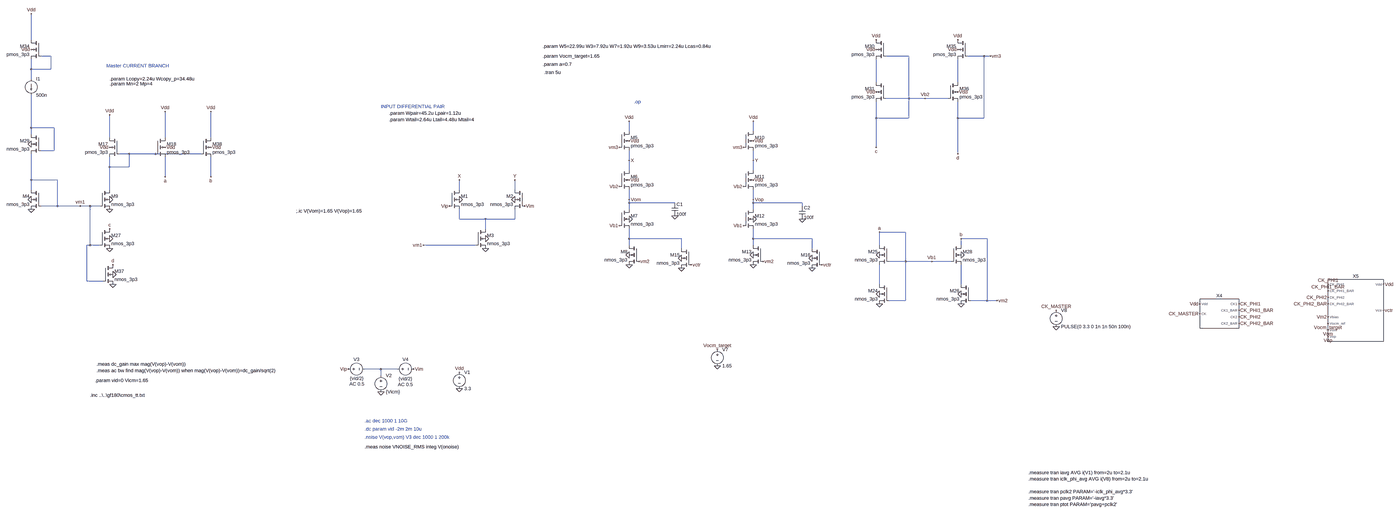
[diagram p0: schematic ota_v2.asc, whole sheet]
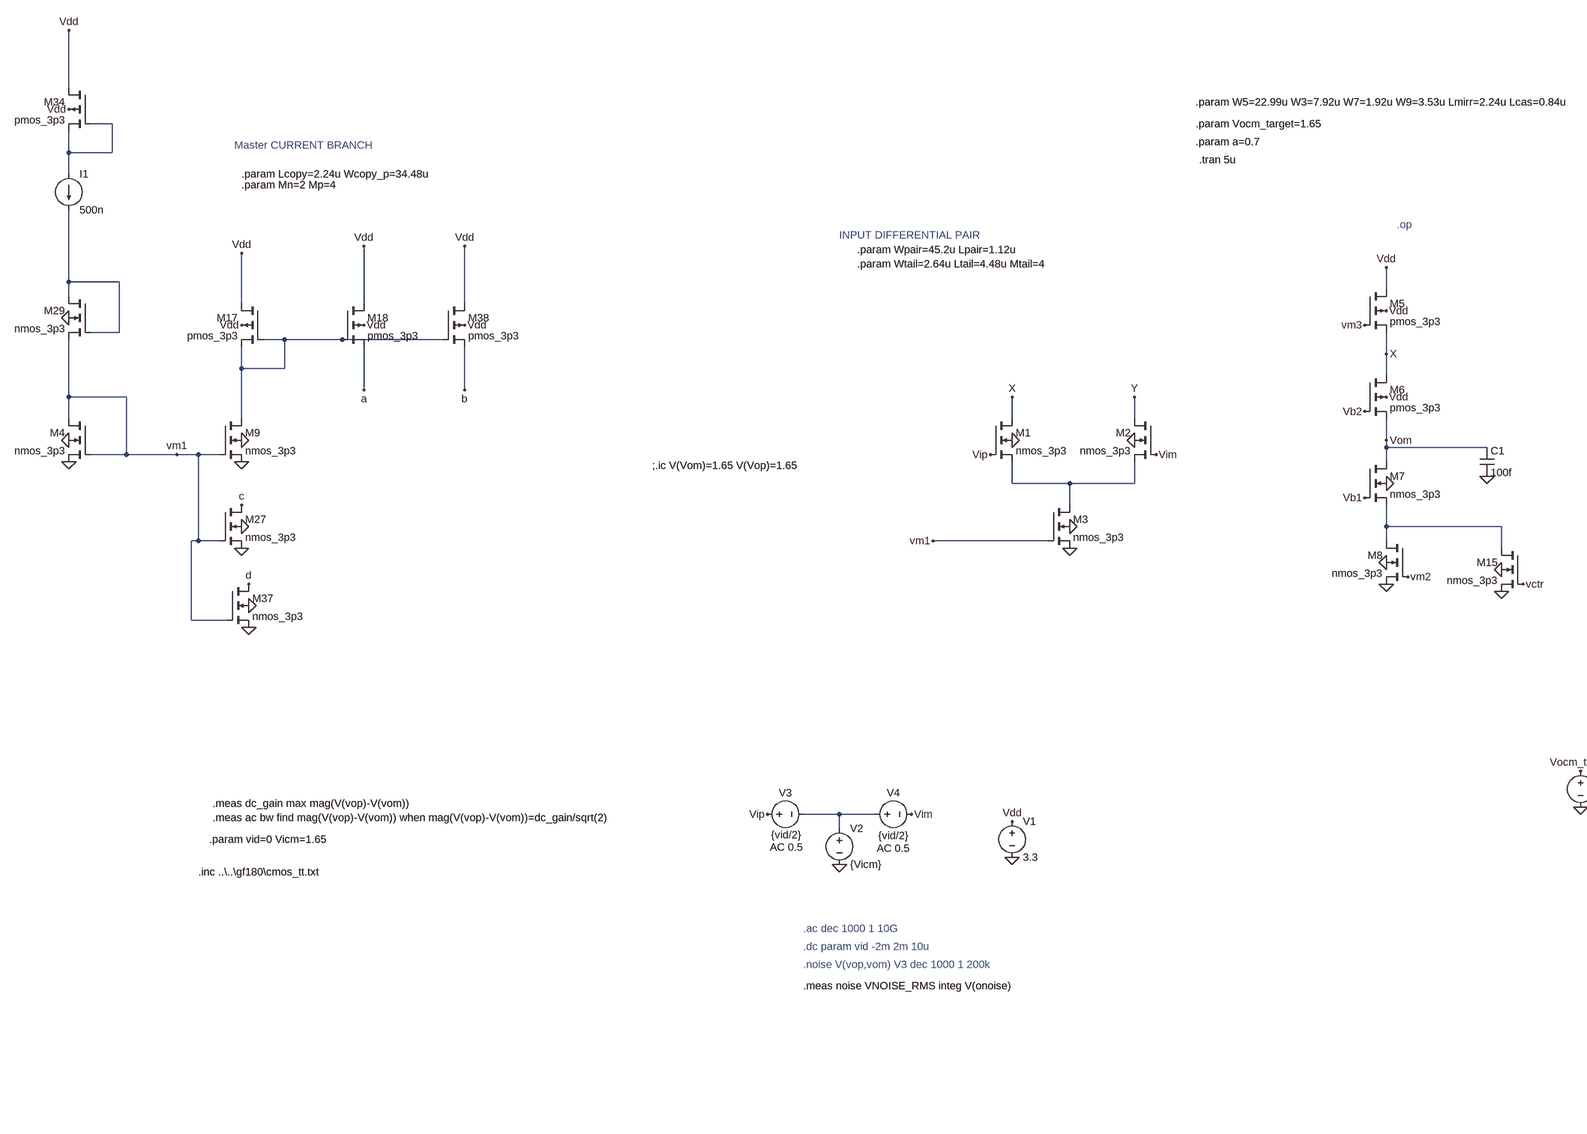
[diagram p1: schematic ota_v2.asc, part, row 1 of 1, column 1 of 2]
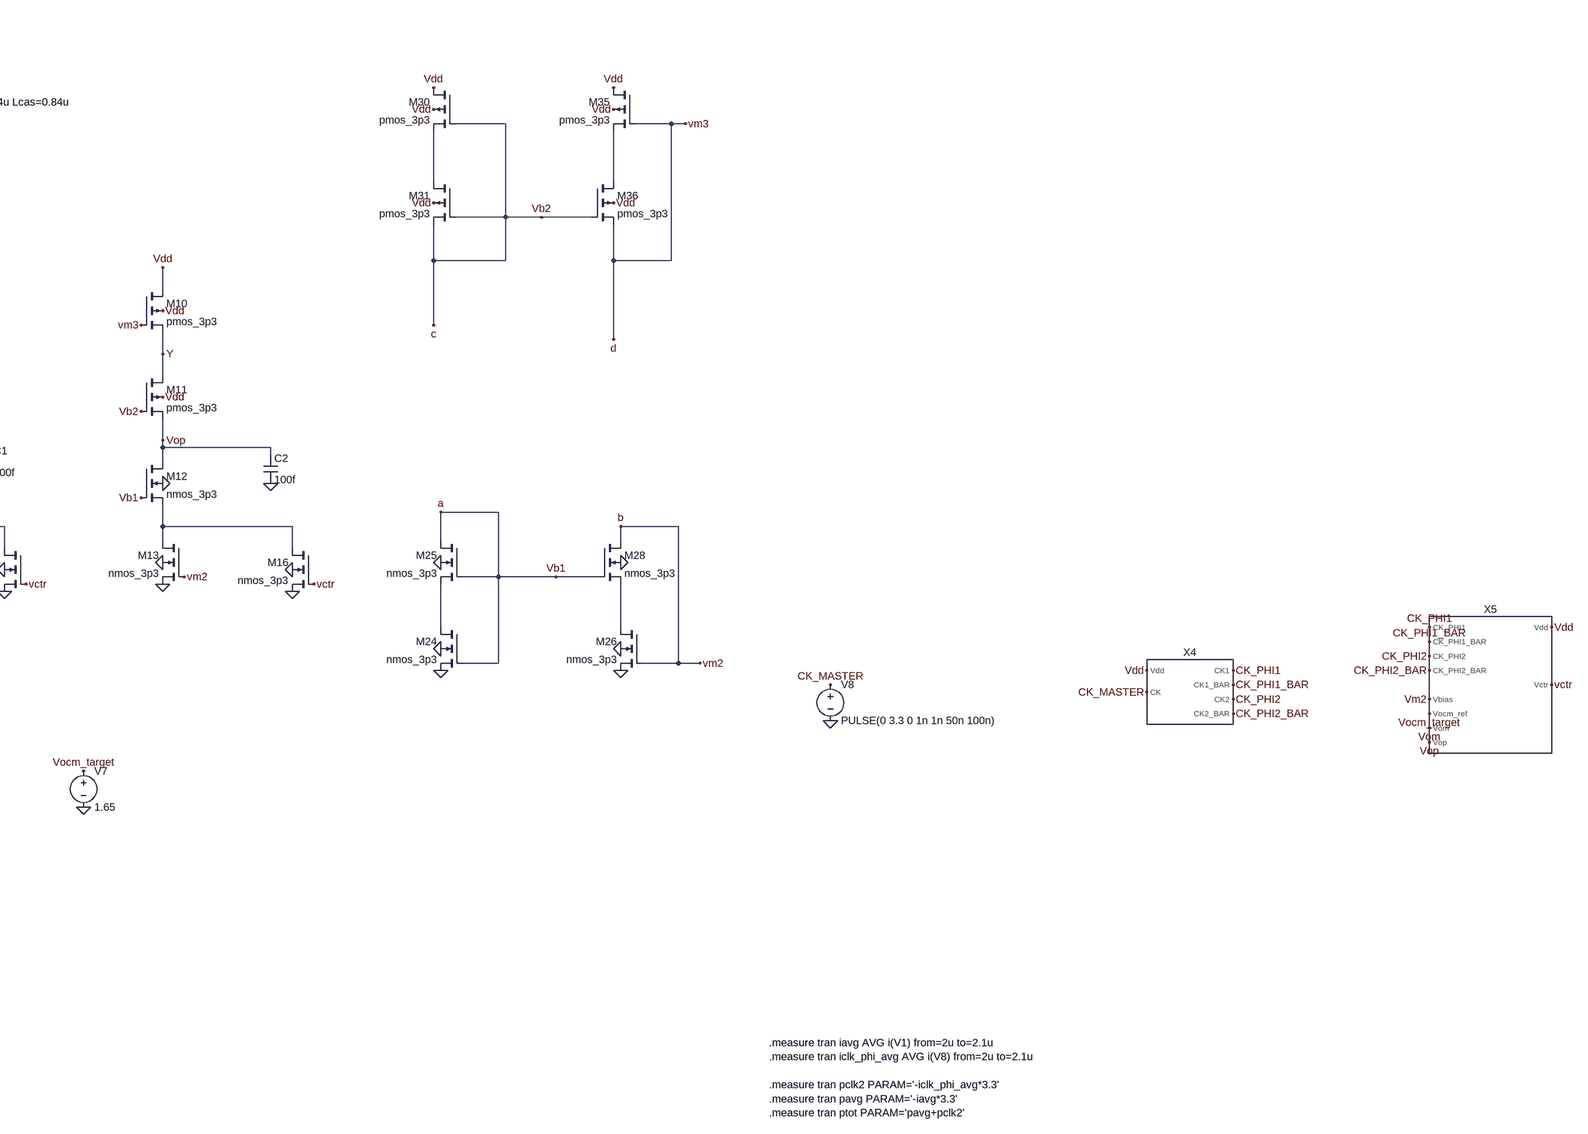
[diagram p2: schematic ota_v2.asc, part, row 1 of 1, column 2 of 2]
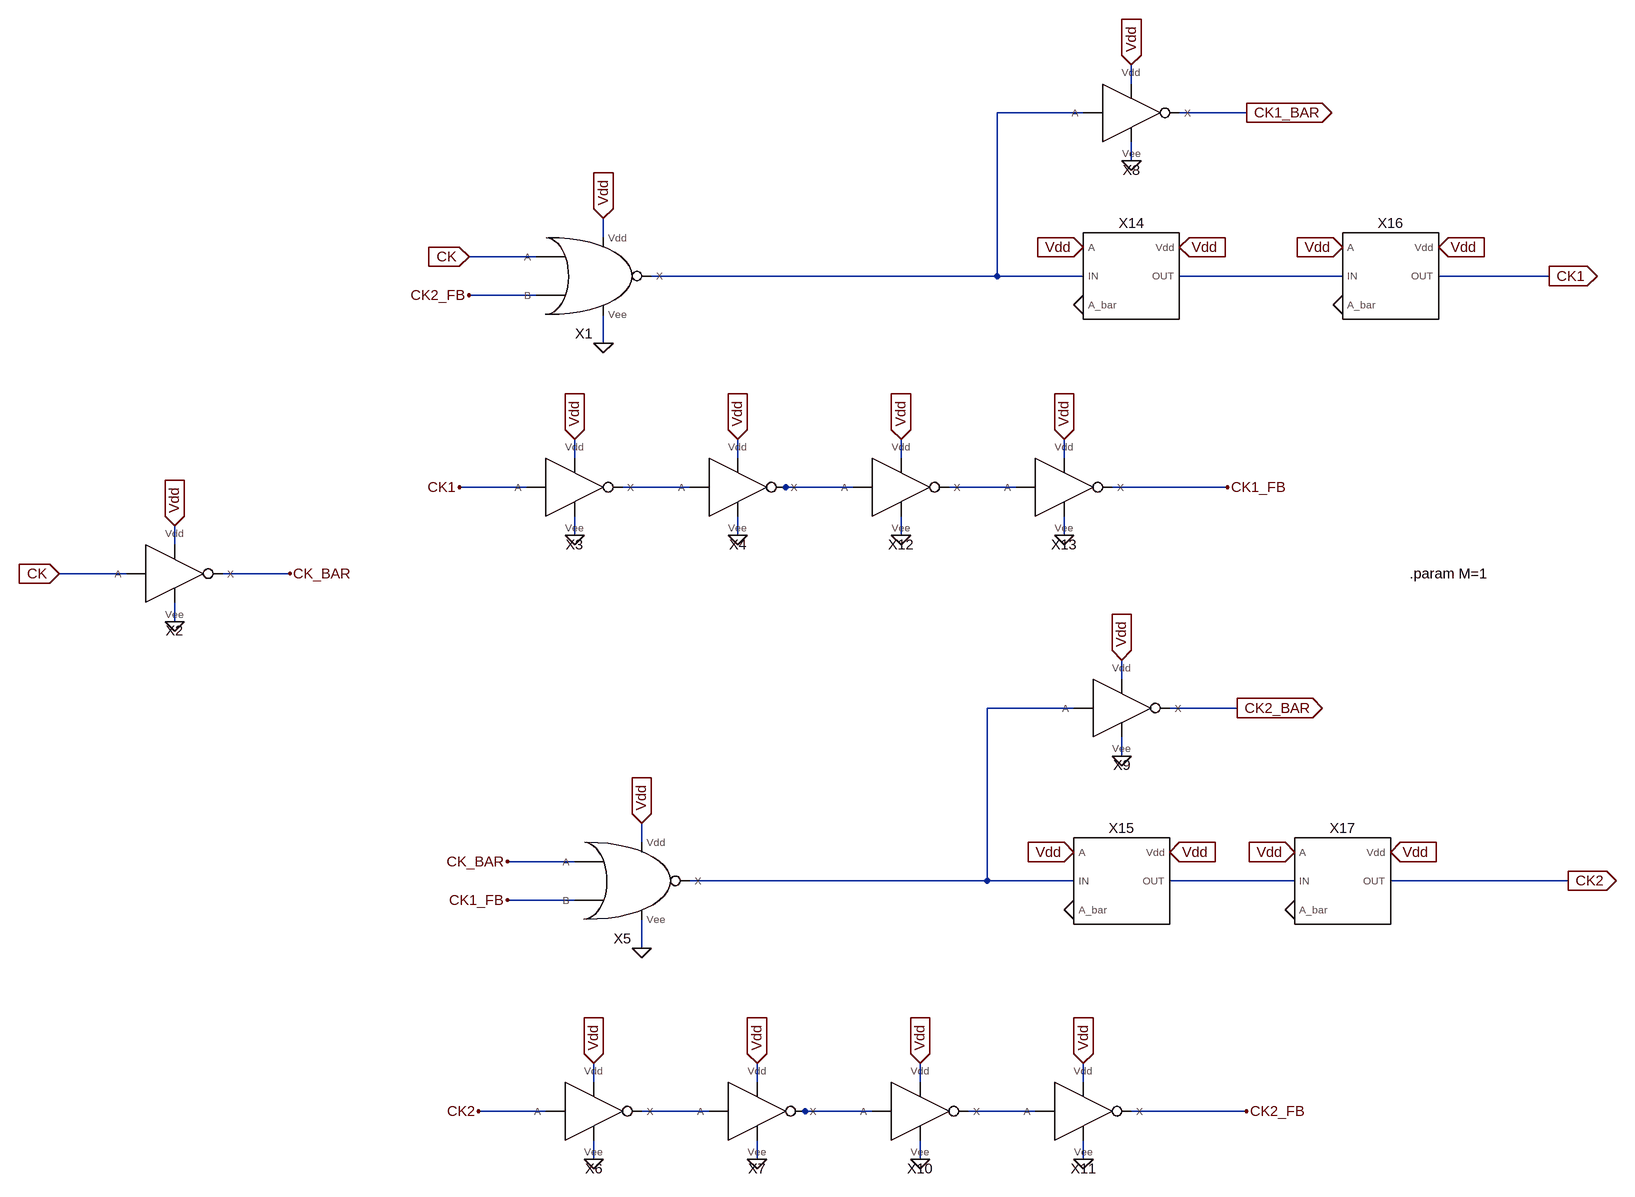
[diagram p3: sub-circuit phase_gen.asc]
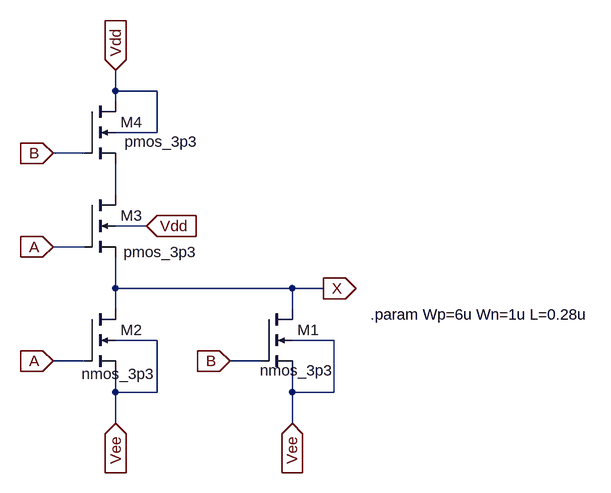
[diagram p4: sub-circuit nor2x1.asc]
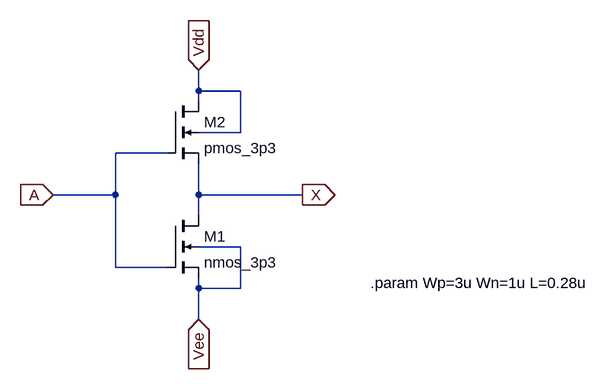
[diagram p5: sub-circuit invx1.asc]
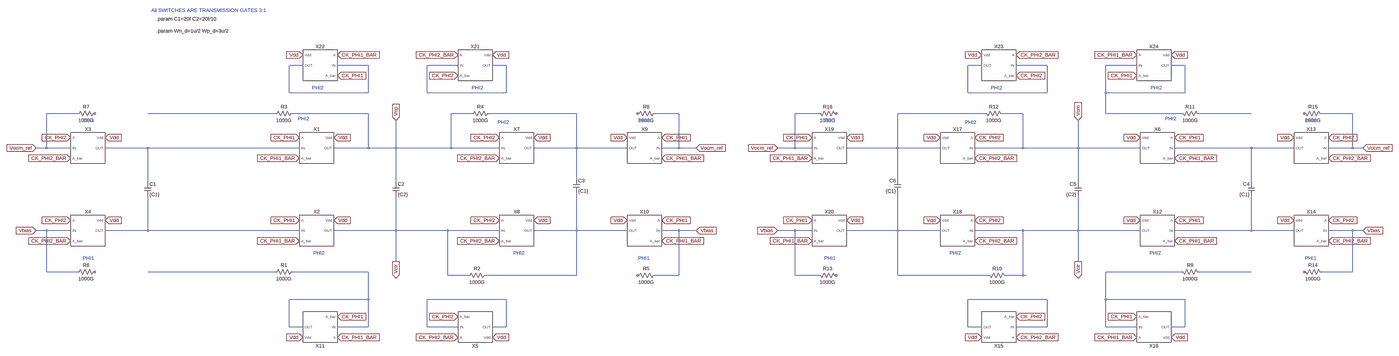
[diagram p6: sub-circuit cs_cmfb_v2.asc, whole sheet]
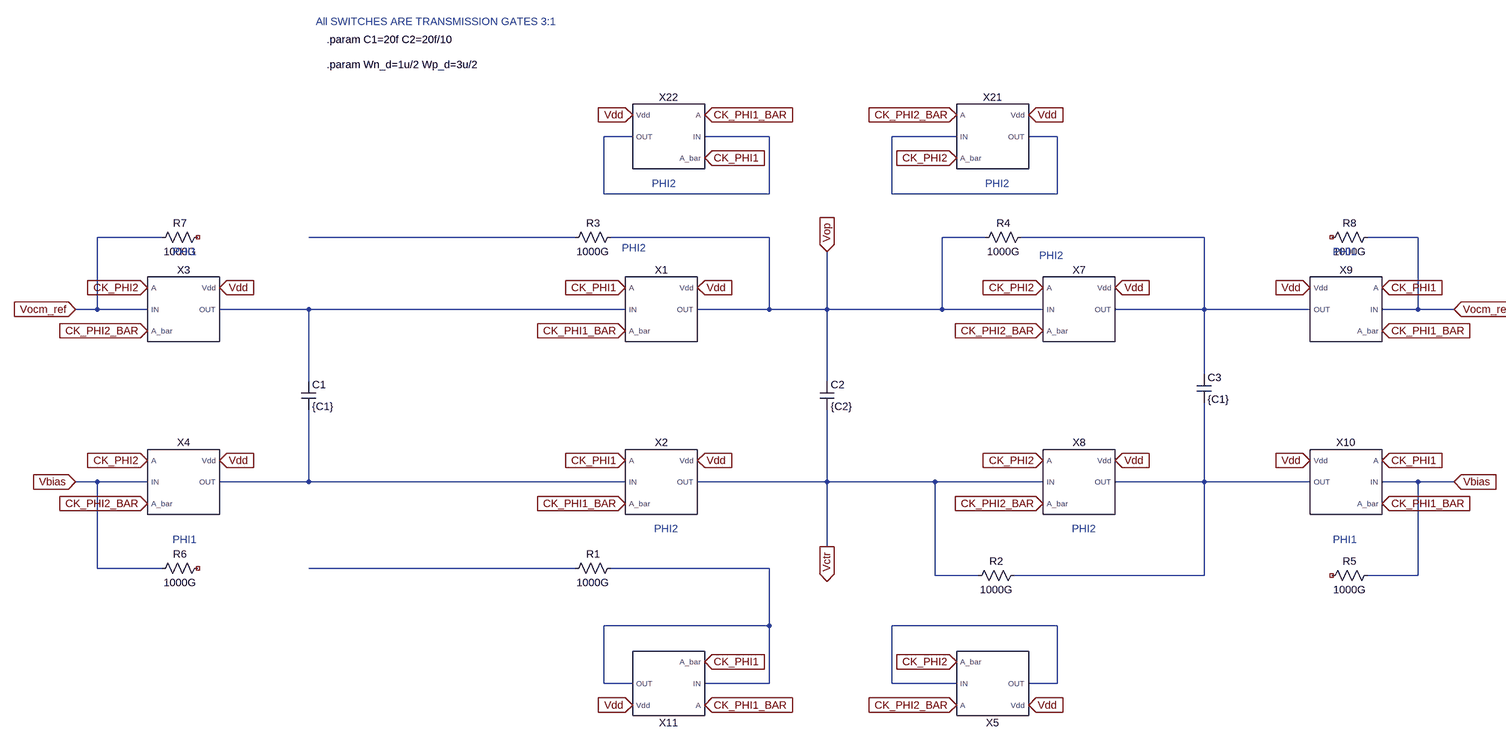
[diagram p7: sub-circuit cs_cmfb_v2.asc, part, row 1 of 1, column 1 of 2]
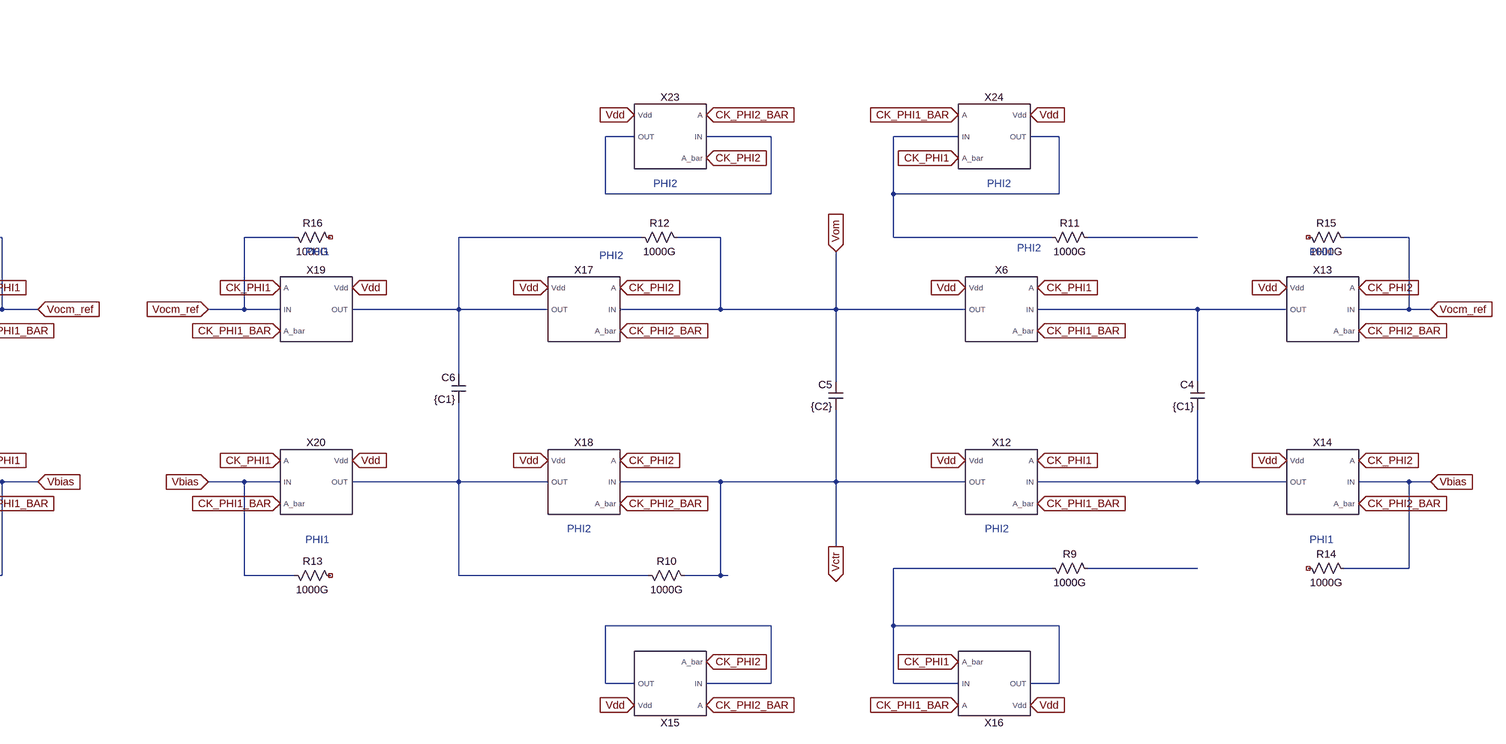
[diagram p8: sub-circuit cs_cmfb_v2.asc, part, row 1 of 1, column 2 of 2]
ota_v2.asc, the LTspice schematic file:
Version 4
SHEET 1 6080 1908
WIRE -1936 -560 -1936 -688
WIRE -1840 -480 -1888 -480
WIRE 3312 -480 3200 -480
WIRE 3680 -480 3600 -480
WIRE 3712 -480 3680 -480
WIRE -1936 -416 -1936 -464
WIRE -1840 -416 -1840 -480
WIRE -1840 -416 -1936 -416
WIRE -1936 -368 -1936 -416
WIRE 3152 -352 3152 -464
WIRE 3552 -352 3552 -464
WIRE 3312 -272 3312 -480
WIRE 3312 -272 3200 -272
WIRE 3392 -272 3312 -272
WIRE 3504 -272 3392 -272
WIRE 3152 -176 3152 -256
WIRE 3312 -176 3312 -272
WIRE 3312 -176 3152 -176
WIRE 3552 -176 3552 -256
WIRE 3680 -176 3680 -480
WIRE 3680 -176 3552 -176
WIRE -1936 -128 -1936 -288
WIRE -1824 -128 -1936 -128
WIRE 1040 -112 1040 -160
WIRE 1648 -112 1648 -160
WIRE -1936 -96 -1936 -128
WIRE -1552 -80 -1552 -192
WIRE -1280 -80 -1280 -208
WIRE -1056 -80 -1056 -208
WIRE 3152 -32 3152 -176
WIRE -1824 -16 -1824 -128
WIRE -1824 -16 -1888 -16
WIRE -1456 0 -1504 0
WIRE -1328 0 -1456 0
WIRE -1104 0 -1328 0
WIRE 3552 0 3552 -176
WIRE 1040 32 1040 -16
WIRE 1648 32 1648 -16
WIRE -1552 64 -1552 16
WIRE -1456 64 -1456 0
WIRE -1456 64 -1552 64
WIRE 1040 80 1040 32
WIRE 1648 80 1648 32
WIRE -1280 112 -1280 16
WIRE -1056 112 -1056 16
WIRE -1936 128 -1936 0
WIRE -1808 128 -1936 128
WIRE -1936 176 -1936 128
WIRE -1552 176 -1552 64
WIRE 208 176 208 128
WIRE 480 176 480 128
WIRE 1040 224 1040 176
WIRE 1648 224 1648 176
WIRE 1040 240 1040 224
WIRE 1264 240 1040 240
WIRE 1648 240 1648 224
WIRE 1888 240 1648 240
WIRE -1808 256 -1808 128
WIRE -1808 256 -1888 256
WIRE -1696 256 -1808 256
WIRE -1648 256 -1696 256
WIRE -1600 256 -1648 256
WIRE 1888 256 1888 240
WIRE 1040 272 1040 240
WIRE 1648 272 1648 240
WIRE 208 320 208 272
WIRE 336 320 208 320
WIRE 480 320 480 272
WIRE 480 320 336 320
WIRE 336 368 336 320
WIRE 3296 384 3168 384
WIRE 1040 416 1040 368
WIRE 1296 416 1040 416
WIRE 1648 416 1648 368
WIRE 1936 416 1648 416
WIRE 3696 416 3568 416
WIRE -1648 448 -1648 256
WIRE -1648 448 -1664 448
WIRE -1600 448 -1648 448
WIRE 288 448 32 448
WIRE 1040 448 1040 416
WIRE 1648 448 1648 416
WIRE 3168 448 3168 384
WIRE 3568 448 3568 416
WIRE 1296 464 1296 416
WIRE 1936 464 1936 416
WIRE 3296 528 3296 384
WIRE 3296 528 3216 528
WIRE 3424 528 3296 528
WIRE 3520 528 3424 528
WIRE -1664 624 -1664 448
WIRE -1584 624 -1664 624
WIRE 3168 640 3168 544
WIRE 3568 640 3568 544
WIRE 3296 720 3296 528
WIRE 3296 720 3216 720
WIRE 3696 720 3696 416
WIRE 3696 720 3616 720
WIRE 3744 720 3696 720
WIRE -176 1056 -256 1056
WIRE -96 1056 -176 1056
WIRE -176 1088 -176 1056
FLAG 336 464 0
FLAG 208 224 0
FLAG 480 224 0
FLAG 336 416 0
FLAG -1936 272 0
FLAG -1936 224 0
FLAG 208 1152 0
FLAG 208 1072 Vdd
FLAG -176 1168 0
FLAG -336 1056 Vip
FLAG -16 1056 Vim
FLAG 160 256 Vip
FLAG 528 256 Vim
FLAG 1040 -160 Vdd
FLAG 1040 544 0
FLAG 1040 496 0
FLAG 1040 320 0
FLAG 1040 32 X
FLAG 1040 128 Vdd
FLAG 992 352 Vb1
FLAG 992 160 Vb2
FLAG 1040 -64 Vdd
FLAG 1648 -160 Vdd
FLAG 1648 544 0
FLAG 1648 496 0
FLAG 1648 320 0
FLAG 1648 32 Y
FLAG 1648 128 Vdd
FLAG 1600 352 Vb1
FLAG 1600 160 Vb2
FLAG 1648 -64 Vdd
FLAG 1696 528 vm2
FLAG 1088 528 vm2
FLAG 1600 -32 vm3
FLAG 992 -32 vm3
FLAG 1648 224 Vop
FLAG 1040 224 Vom
FLAG 208 128 X
FLAG 480 128 Y
FLAG 1472 1040 0
FLAG 1472 960 Vocm_target
FLAG -1696 256 vm1
FLAG 1296 560 0
FLAG 1296 512 0
FLAG 1344 544 vctr
FLAG 1936 560 0
FLAG 1936 512 0
FLAG 1984 544 vctr
FLAG 1264 304 0
FLAG 1888 320 0
FLAG 32 448 vm1
FLAG -1552 272 0
FLAG -1552 224 0
FLAG -1552 -32 Vdd
FLAG -1552 -192 Vdd
FLAG -1280 -32 Vdd
FLAG -1280 -208 Vdd
FLAG -1280 112 a
FLAG -1552 464 0
FLAG -1552 416 0
FLAG -1552 368 c
FLAG -1936 -688 Vdd
FLAG -1936 -48 0
FLAG -1936 -512 Vdd
FLAG 3168 736 0
FLAG 3168 688 0
FLAG 3168 496 0
FLAG 3568 736 0
FLAG 3568 688 0
FLAG 3744 720 vm2
FLAG 3568 496 0
FLAG 3424 528 Vb1
FLAG 3152 -512 Vdd
FLAG 3152 -560 Vdd
FLAG 3152 -304 Vdd
FLAG 3552 -512 Vdd
FLAG 3552 -560 Vdd
FLAG 3552 -304 Vdd
FLAG 3712 -480 vm3
FLAG 3392 -272 Vb2
FLAG 3168 384 a
FLAG 3568 416 b
FLAG 3152 -32 c
FLAG 3552 0 d
FLAG -1536 640 0
FLAG -1536 592 0
FLAG -1536 544 d
FLAG -1056 -32 Vdd
FLAG -1056 -208 Vdd
FLAG -1056 112 b
FLAG 5744 704 CK_PHI2
FLAG 5744 640 CK_PHI1
FLAG 5744 736 CK_PHI2_BAR
FLAG 5744 672 CK_PHI1_BAR
FLAG 6016 640 Vdd
FLAG 5744 800 Vm2
FLAG 6016 768 vctr
FLAG 5744 832 Vocm_target
FLAG 5744 864 Vom
FLAG 5744 896 Vop
FLAG 4224 848 0
FLAG 4224 768 CK_MASTER
FLAG 4976 736 Vdd
FLAG 4976 784 CK_MASTER
FLAG 5168 736 CK_PHI1
FLAG 5168 768 CK_PHI1_BAR
FLAG 5168 800 CK_PHI2
FLAG 5168 832 CK_PHI2_BAR
SYMBOL nmos4 160 176 R0
SYMATTR InstName M1
SYMATTR Value nmos_3p3
SYMATTR Value2 l='Lpair' w='Wpair' m=1
SYMBOL nmos4 528 176 M0
SYMATTR InstName M2
SYMATTR Value nmos_3p3
SYMATTR Value2 l='Lpair' w='Wpair' m=1
SYMBOL nmos4 288 368 R0
SYMATTR InstName M3
SYMATTR Value nmos_3p3
SYMATTR Value2 l='Ltail' w='Wtail/Mtail' m=Mtail
SYMBOL nmos4 -1888 176 M0
SYMATTR InstName M4
SYMATTR Value nmos_3p3
SYMATTR Value2 l='Ltail' w='Wtail/Mtail' m=1
SYMBOL voltage 208 1056 R0
WINDOW 123 24 124 Left 2
WINDOW 39 0 0 Left 0
SYMATTR InstName V1
SYMATTR Value 3.3
SYMBOL voltage -176 1072 R0
WINDOW 123 24 124 Left 2
WINDOW 39 0 0 Left 0
SYMATTR InstName V2
SYMATTR Value {Vicm}
SYMBOL voltage -352 1056 R270
WINDOW 0 32 56 VTop 2
WINDOW 3 -30 58 VBottom 2
WINDOW 123 -58 58 VBottom 2
WINDOW 39 0 0 Left 0
SYMATTR InstName V3
SYMATTR Value {vid/2}
SYMATTR Value2 AC 0.5
SYMBOL voltage -112 1056 R270
WINDOW 0 32 56 VTop 2
WINDOW 3 -32 56 VBottom 2
WINDOW 123 -60 56 VBottom 2
WINDOW 39 0 0 Left 0
SYMATTR InstName V4
SYMATTR Value {vid/2}
SYMATTR Value2 AC 0.5
SYMBOL pmos4 992 -112 R0
SYMATTR InstName M5
SYMATTR Value pmos_3p3
SYMATTR Value2 l='Lmirr' w='W5/3' m=3
SYMBOL pmos4 992 80 R0
SYMATTR InstName M6
SYMATTR Value pmos_3p3
SYMATTR Value2 l='Lcas' w='W3/2' m=2
SYMBOL nmos4 992 272 R0
SYMATTR InstName M7
SYMATTR Value nmos_3p3
SYMATTR Value2 l='Lcas' w='W7'
SYMBOL nmos4 1088 448 M0
SYMATTR InstName M8
SYMATTR Value nmos_3p3
SYMATTR Value2 l='Lmirr' w='a*W9'
SYMBOL pmos4 1600 -112 R0
SYMATTR InstName M10
SYMATTR Value pmos_3p3
SYMATTR Value2 l='Lmirr' w='W5/3' m=3
SYMBOL pmos4 1600 80 R0
SYMATTR InstName M11
SYMATTR Value pmos_3p3
SYMATTR Value2 l='Lcas' w='W3/2' m=2
SYMBOL nmos4 1600 272 R0
SYMATTR InstName M12
SYMATTR Value nmos_3p3
SYMATTR Value2 l='Lcas' w='W7'
SYMBOL nmos4 1696 448 M0
SYMATTR InstName M13
SYMATTR Value nmos_3p3
SYMATTR Value2 l='Lmirr' w='a*W9'
SYMBOL voltage 1472 944 R0
WINDOW 123 0 0 Left 0
WINDOW 39 0 0 Left 0
SYMATTR InstName V7
SYMATTR Value 1.65
SYMBOL nmos4 1344 464 M0
SYMATTR InstName M15
SYMATTR Value nmos_3p3
SYMATTR Value2 l='Lmirr' w='(1-a)*W9'
SYMBOL nmos4 1984 464 M0
SYMATTR InstName M16
SYMATTR Value nmos_3p3
SYMATTR Value2 l='Lmirr' w='(1-a)*W9'
SYMBOL cap 1248 240 R0
SYMATTR InstName C1
SYMATTR Value 100f
SYMBOL cap 1872 256 R0
SYMATTR InstName C2
SYMATTR Value 100f
SYMBOL current -1936 -368 R0
WINDOW 123 0 0 Left 0
WINDOW 39 0 0 Left 0
SYMATTR InstName I1
SYMATTR Value 500n
SYMBOL nmos4 -1600 176 R0
SYMATTR InstName M9
SYMATTR Value nmos_3p3
SYMATTR Value2 l='Ltail' w='Wtail/Mtail' m=Mp
SYMBOL pmos4 -1504 -80 M0
SYMATTR InstName M17
SYMATTR Value pmos_3p3
SYMATTR Value2 l='Lcopy' w='Wcopy_p'
SYMBOL pmos4 -1328 -80 R0
SYMATTR InstName M18
SYMATTR Value pmos_3p3
SYMATTR Value2 l='Lcopy' w='Wcopy_p'
SYMBOL nmos4 -1600 368 R0
SYMATTR InstName M27
SYMATTR Value nmos_3p3
SYMATTR Value2 l='Ltail' w='Wtail/Mtail' m=Mn
SYMBOL nmos4 -1888 -96 M0
SYMATTR InstName M29
SYMATTR Value nmos_3p3
SYMATTR Value2 l=4.48u w=2.64u m=3
SYMBOL pmos4 -1888 -560 M0
SYMATTR InstName M34
SYMATTR Value pmos_3p3
SYMATTR Value2 l=4.48u w='Wcopy_p'
SYMBOL nmos4 3216 640 M0
SYMATTR InstName M24
SYMATTR Value nmos_3p3
SYMATTR Value2 l='Lmirr' w='(1/3)*W9' m=1
SYMBOL nmos4 3216 448 M0
SYMATTR InstName M25
SYMATTR Value nmos_3p3
SYMATTR Value2 l='Lcas' w='W7' m=1
SYMBOL nmos4 3616 640 M0
SYMATTR InstName M26
SYMATTR Value nmos_3p3
SYMATTR Value2 l='Lmirr' w='W9' m=1
SYMBOL nmos4 3520 448 R0
SYMATTR InstName M28
SYMATTR Value nmos_3p3
SYMATTR Value2 l='Lcas' w='W7' m=1
SYMBOL pmos4 3200 -560 M0
SYMATTR InstName M30
SYMATTR Value pmos_3p3
SYMATTR Value2 l='Lmirr' w='(1/3)*W5/3'
SYMBOL pmos4 3200 -352 M0
SYMATTR InstName M31
SYMATTR Value pmos_3p3
SYMATTR Value2 l='Lcas' w='W3/2' m=1
SYMBOL pmos4 3600 -560 M0
SYMATTR InstName M35
SYMATTR Value pmos_3p3
SYMATTR Value2 l='Lmirr' w='W5/3' m=1
SYMBOL pmos4 3504 -352 R0
SYMATTR InstName M36
SYMATTR Value pmos_3p3
SYMATTR Value2 l='Lcas' w='W3/2' m=1
SYMBOL nmos4 -1584 544 R0
SYMATTR InstName M37
SYMATTR Value nmos_3p3
SYMATTR Value2 l='Ltail' w='Wtail/Mtail' m=Mn
SYMBOL pmos4 -1104 -80 R0
SYMATTR InstName M38
SYMATTR Value pmos_3p3
SYMATTR Value2 l='Lcopy' w='Wcopy_p'
SYMBOL voltage 4224 752 R0
WINDOW 123 0 0 Left 0
WINDOW 39 0 0 Left 0
SYMATTR InstName V8
SYMATTR Value PULSE(0 3.3 0 1n 1n 50n 100n)
SYMBOL PHASE_GEN 5072 784 R0
SYMATTR InstName X4
SYMBOL CS_CMFB_V2 5872 768 R0
SYMATTR InstName X5
TEXT -136 -200 Left 2 !.param Wpair=45.2u Lpair=1.12u
TEXT -136 -168 Left 2 !.param Wtail=2.64u Ltail=4.48u Mtail=4
TEXT -1624 1112 Left 2 !.param vid=0 Vicm=1.65
TEXT -1648 1184 Left 2 !.inc ..\\..\\gf180\\cmos_tt.txt
TEXT 1064 -256 Left 2 ;.op
TEXT 616 -528 Left 2 !.param W5=22.99u W3=7.92u W7=1.92u W9=3.53u Lmirr=2.24u Lcas=0.84u
TEXT 616 -480 Left 2 !.param Vocm_target=1.65
TEXT 624 -400 Left 2 !.tran 5u
TEXT 616 -440 Left 2 !.param a=0.7
TEXT -256 1400 Left 2 ;.ac dec 1000 1 10G
TEXT -256 1440 Left 2 ;.dc param vid -2m 2m 10u
TEXT -1616 1032 Left 2 !.meas dc_gain max mag(V(vop)-V(vom))\n.meas ac bw find mag(V(vop)-V(vom)) when mag(V(vop)-V(vom))=dc_gain/sqrt(2)
TEXT -1552 -368 Left 2 !.param Lcopy=2.24u Wcopy_p=34.48u
TEXT -1568 -432 Left 2 ;Master CURRENT BRANCH
TEXT -176 -232 Left 2 ;INPUT DIFFERENTIAL PAIR
TEXT -256 1480 Left 2 ;.noise V(vop,vom) V3 dec 1000 1 200k
TEXT -256 1528 Left 2 !.meas noise VNOISE_RMS integ V(onoise)
TEXT -592 280 Left 2 !;.ic V(Vom)=1.65 V(Vop)=1.65
TEXT -1552 -344 Left 2 !.param Mn=2 Mp=4
TEXT 4088 1696 Left 2 !.measure tran iavg AVG i(V1) from=2u to=2.1u\n.measure tran iclk_phi_avg AVG i(V8) from=2u to=2.1u\n \n.measure tran pclk2 PARAM='-iclk_phi_avg*3.3'\n.measure tran pavg PARAM='-iavg*3.3'\n.measure tran ptot PARAM='pavg+pclk2'

phase_gen.asc, the sub-circuit schematic file:
Version 4
SHEET 1 3208 1200
WIRE 1856 -656 1856 -688
WIRE 1776 -608 1632 -608
WIRE 2048 -608 1936 -608
WIRE 1856 -528 1856 -560
WIRE 976 -400 976 -432
WIRE 864 -368 752 -368
WIRE 1632 -336 1632 -608
WIRE 1632 -336 1056 -336
WIRE 1776 -336 1632 -336
WIRE 2208 -336 1936 -336
WIRE 2752 -336 2368 -336
WIRE 864 -304 752 -304
WIRE 976 -224 976 -272
WIRE 928 -32 928 -64
WIRE 1200 -32 1200 -64
WIRE 1472 -32 1472 -64
WIRE 1744 -32 1744 -64
WIRE 848 16 736 16
WIRE 1120 16 1008 16
WIRE 1280 16 1264 16
WIRE 1392 16 1280 16
WIRE 1664 16 1552 16
WIRE 2016 16 1824 16
WIRE 928 96 928 64
WIRE 1200 96 1200 64
WIRE 1472 96 1472 64
WIRE 1744 96 1744 64
WIRE -192 112 -192 80
WIRE -272 160 -384 160
WIRE 0 160 -112 160
WIRE -192 240 -192 208
WIRE 1840 336 1840 304
WIRE 1760 384 1616 384
WIRE 2032 384 1920 384
WIRE 1840 464 1840 432
WIRE 1040 608 1040 576
WIRE 928 640 816 640
WIRE 1616 672 1616 384
WIRE 1616 672 1120 672
WIRE 1760 672 1616 672
WIRE 2128 672 1920 672
WIRE 2784 672 2288 672
WIRE 928 704 816 704
WIRE 1040 784 1040 736
WIRE 960 1008 960 976
WIRE 1232 1008 1232 976
WIRE 1504 1008 1504 976
WIRE 1776 1008 1776 976
WIRE 880 1056 768 1056
WIRE 1152 1056 1040 1056
WIRE 1312 1056 1296 1056
WIRE 1424 1056 1312 1056
WIRE 1696 1056 1584 1056
WIRE 2048 1056 1856 1056
WIRE 960 1136 960 1104
WIRE 1232 1136 1232 1104
WIRE 1504 1136 1504 1104
WIRE 1776 1136 1776 1104
FLAG 752 -368 CK
IOPIN 752 -368 In
FLAG 976 -224 0
FLAG -384 160 CK
IOPIN -384 160 In
FLAG 0 160 CK_BAR
FLAG -192 80 Vdd
IOPIN -192 80 In
FLAG 976 -432 Vdd
IOPIN 976 -432 In
FLAG -192 240 0
FLAG 2752 -336 CK1
IOPIN 2752 -336 Out
FLAG 816 640 CK_BAR
FLAG 1040 784 0
FLAG 1040 576 Vdd
IOPIN 1040 576 In
FLAG 768 1056 CK2
FLAG 960 976 Vdd
IOPIN 960 976 In
FLAG 960 1136 0
FLAG 1232 976 Vdd
IOPIN 1232 976 In
FLAG 1232 1136 0
FLAG 816 704 CK1_FB
FLAG 752 -304 CK2_FB
FLAG 1856 -688 Vdd
IOPIN 1856 -688 In
FLAG 1856 -528 0
FLAG 2048 -608 CK1_BAR
IOPIN 2048 -608 Out
FLAG 2784 672 CK2
IOPIN 2784 672 Out
FLAG 1840 304 Vdd
IOPIN 1840 304 In
FLAG 1840 464 0
FLAG 2048 1056 CK2_FB
FLAG 1504 976 Vdd
IOPIN 1504 976 In
FLAG 1504 1136 0
FLAG 1776 976 Vdd
IOPIN 1776 976 In
FLAG 1776 1136 0
FLAG 736 16 CK1
FLAG 928 -64 Vdd
IOPIN 928 -64 In
FLAG 928 96 0
FLAG 1200 -64 Vdd
IOPIN 1200 -64 In
FLAG 1200 96 0
FLAG 2016 16 CK1_FB
FLAG 1472 -64 Vdd
IOPIN 1472 -64 In
FLAG 1472 96 0
FLAG 1744 -64 Vdd
IOPIN 1744 -64 In
FLAG 1744 96 0
FLAG 2032 384 CK2_BAR
IOPIN 2032 384 Out
FLAG 1936 -384 Vdd
IOPIN 1936 -384 In
FLAG 1776 -384 Vdd
IOPIN 1776 -384 In
FLAG 1920 624 Vdd
IOPIN 1920 624 In
FLAG 1760 624 Vdd
IOPIN 1760 624 In
FLAG 1760 720 0
FLAG 1776 -288 0
FLAG 2368 -384 Vdd
IOPIN 2368 -384 In
FLAG 2208 -384 Vdd
IOPIN 2208 -384 In
FLAG 2208 -288 0
FLAG 2288 624 Vdd
IOPIN 2288 624 In
FLAG 2128 624 Vdd
IOPIN 2128 624 In
FLAG 2128 720 0
SYMBOL NOR2x1 944 -336 R0
SYMATTR InstName X1
SYMBOL INVx1 -192 160 R0
SYMATTR InstName X2
SYMBOL NOR2x1 1008 672 R0
SYMATTR InstName X5
SYMBOL INVx1 960 1056 R0
SYMATTR InstName X6
SYMBOL INVx1 1232 1056 R0
SYMATTR InstName X7
SYMBOL INVx1 1856 -608 R0
SYMATTR InstName X8
SYMBOL INVx1 1840 384 R0
SYMATTR InstName X9
SYMBOL INVx1 1504 1056 R0
SYMATTR InstName X10
SYMBOL INVx1 1776 1056 R0
SYMATTR InstName X11
SYMBOL INVx1 928 16 R0
SYMATTR InstName X3
SYMBOL INVx1 1200 16 R0
SYMATTR InstName X4
SYMBOL INVx1 1472 16 R0
SYMATTR InstName X12
SYMBOL INVx1 1744 16 R0
SYMATTR InstName X13
SYMBOL tgate 1856 -336 R0
SYMATTR InstName X14
SYMATTR SpiceLine L=0.28u Wn=1u Wp=3u M={M}
SYMBOL tgate 1840 672 R0
SYMATTR InstName X15
SYMATTR SpiceLine L=0.28u Wn=1u Wp=3u M={M}
SYMBOL tgate 2288 -336 R0
SYMATTR InstName X16
SYMATTR SpiceLine L=0.28u Wn=1u Wp=3u M={M}
SYMBOL tgate 2208 672 R0
SYMATTR InstName X17
SYMATTR SpiceLine L=0.28u Wn=1u Wp=3u M={M}
TEXT 2320 160 Left 2 !.param M=1

nor2x1.asc, the sub-circuit schematic file:
Version 4.1
SHEET 1 2956 680
WIRE 1680 -496 1680 -528
WIRE 1744 -496 1680 -496
WIRE 1680 -480 1680 -496
WIRE 1744 -432 1744 -496
WIRE 1744 -432 1680 -432
WIRE 1632 -400 1584 -400
WIRE 1680 -336 1680 -384
WIRE 1728 -288 1680 -288
WIRE 1632 -256 1584 -256
WIRE 1680 -192 1680 -240
WIRE 1952 -192 1680 -192
WIRE 2000 -192 1952 -192
WIRE 1680 -160 1680 -192
WIRE 1952 -160 1952 -192
WIRE 1744 -112 1680 -112
WIRE 2016 -112 1952 -112
WIRE 1632 -80 1584 -80
WIRE 1904 -80 1856 -80
WIRE 1680 -32 1680 -64
WIRE 1744 -32 1744 -112
WIRE 1744 -32 1680 -32
WIRE 1952 -32 1952 -64
WIRE 2016 -32 2016 -112
WIRE 2016 -32 1952 -32
WIRE 1680 16 1680 -32
WIRE 1952 16 1952 -32
FLAG 1584 -256 A
IOPIN 1584 -256 In
FLAG 2000 -192 X
IOPIN 2000 -192 Out
FLAG 1680 -528 Vdd
IOPIN 1680 -528 In
FLAG 1584 -80 A
IOPIN 1584 -80 In
FLAG 1856 -80 B
IOPIN 1856 -80 In
FLAG 1584 -400 B
IOPIN 1584 -400 In
FLAG 1952 16 Vee
IOPIN 1952 16 In
FLAG 1680 16 Vee
IOPIN 1680 16 In
FLAG 1728 -288 Vdd
IOPIN 1728 -288 In
SYMBOL nmos4 1904 -160 R0
WINDOW 3 -2 94 Left 2
SYMATTR Value nmos_3p3
SYMATTR InstName M1
SYMATTR Value2 l={L} w={Wn}
SYMBOL nmos4 1632 -336 R0
WINDOW 3 60 88 Left 2
SYMATTR Value pmos_3p3
SYMATTR InstName M3
SYMATTR Value2 l={L} w={Wp}
SYMBOL nmos4 1632 -480 R0
WINDOW 3 62 62 Left 2
SYMATTR Value pmos_3p3
SYMATTR InstName M4
SYMATTR Value2 l={L} w={Wp}
SYMBOL nmos4 1632 -160 R0
WINDOW 3 -4 100 Left 2
SYMATTR Value nmos_3p3
SYMATTR InstName M2
SYMATTR Value2 l={L} w={Wn}
TEXT 2072 -152 Left 2 !.param Wp=6u Wn=1u L=0.28u

invx1.asc, the sub-circuit schematic file:
Version 4.1
SHEET 1 2776 836
WIRE 416 -16 416 -48
WIRE 480 -16 416 -16
WIRE 416 0 416 -16
WIRE 480 48 480 -16
WIRE 480 48 416 48
WIRE 368 80 288 80
WIRE 288 144 288 80
WIRE 288 144 192 144
WIRE 416 144 416 96
WIRE 576 144 416 144
WIRE 416 176 416 144
WIRE 480 224 416 224
WIRE 288 256 288 144
WIRE 368 256 288 256
WIRE 416 288 416 272
WIRE 480 288 480 224
WIRE 480 288 416 288
WIRE 416 336 416 288
FLAG 416 -48 Vdd
IOPIN 416 -48 In
FLAG 192 144 A
IOPIN 192 144 In
FLAG 576 144 X
IOPIN 576 144 Out
FLAG 416 336 Vee
IOPIN 416 336 In
SYMBOL nmos4 368 176 R0
SYMATTR InstName M1
SYMATTR Value nmos_3p3
SYMATTR Value2 l={L} w={Wn}
SYMBOL nmos4 368 0 R0
SYMATTR InstName M2
SYMATTR Value pmos_3p3
SYMATTR Value2 l={L} w={Wp}
TEXT 680 280 Left 2 !.param Wp=3u Wn=1u L=0.28u

cs_cmfb_v2.asc, the sub-circuit schematic file:
Version 4
SHEET 1 4968 1400
WIRE -1040 -368 -1104 -368
WIRE -736 -368 -880 -368
WIRE -320 -368 -464 -368
WIRE -96 -368 -160 -368
WIRE 2672 -368 2608 -368
WIRE 2976 -368 2832 -368
WIRE 3392 -368 3248 -368
WIRE 3616 -368 3552 -368
WIRE -1104 -240 -1104 -368
WIRE -736 -240 -736 -368
WIRE -736 -240 -1104 -240
WIRE -464 -240 -464 -368
WIRE -96 -240 -96 -368
WIRE -96 -240 -464 -240
WIRE 2608 -240 2608 -368
WIRE 2976 -240 2976 -368
WIRE 2976 -240 2608 -240
WIRE 3248 -240 3248 -368
WIRE 3616 -240 3616 -368
WIRE 3616 -240 3248 -240
WIRE -2096 -144 -2240 -144
WIRE -1168 -144 -1760 -144
WIRE -736 -144 -1088 -144
WIRE -256 -144 -352 -144
WIRE 320 -144 -176 -144
WIRE 832 -144 720 -144
WIRE 1792 -144 1680 -144
WIRE 2688 -144 2192 -144
WIRE 2864 -144 2768 -144
WIRE 3248 -144 3248 -240
WIRE 3600 -144 3248 -144
WIRE 4272 -144 3680 -144
WIRE 4752 -144 4608 -144
WIRE -2240 16 -2240 -144
WIRE -2240 16 -2288 16
WIRE -2128 16 -2240 16
WIRE -1760 16 -1968 16
WIRE -1056 16 -1760 16
WIRE -736 16 -736 -144
WIRE -736 16 -896 16
WIRE -608 16 -608 -112
WIRE -608 16 -736 16
WIRE -352 16 -352 -144
WIRE -352 16 -608 16
WIRE -128 16 -352 16
WIRE 320 16 320 -144
WIRE 320 16 32 16
WIRE 592 16 320 16
WIRE 832 16 832 -144
WIRE 832 16 752 16
WIRE 912 16 832 16
WIRE 1680 16 1680 -144
WIRE 1680 16 1600 16
WIRE 1760 16 1680 16
WIRE 2192 16 2192 -144
WIRE 2192 16 1920 16
WIRE 2480 16 2192 16
WIRE 2864 16 2864 -144
WIRE 2864 16 2640 16
WIRE 3120 16 3120 -112
WIRE 3120 16 2864 16
WIRE 3408 16 3120 16
WIRE 4272 16 3568 16
WIRE 4480 16 4272 16
WIRE 4752 16 4752 -144
WIRE 4752 16 4640 16
WIRE 4800 16 4752 16
WIRE 320 160 320 16
WIRE 2192 160 2192 16
WIRE -1760 176 -1760 16
WIRE -608 176 -608 16
WIRE 3120 176 3120 16
WIRE 4272 176 4272 16
WIRE -2240 400 -2288 400
WIRE -2128 400 -2240 400
WIRE -1760 400 -1760 240
WIRE -1760 400 -1968 400
WIRE -1056 400 -1760 400
WIRE -608 400 -608 240
WIRE -608 400 -896 400
WIRE -368 400 -608 400
WIRE -128 400 -368 400
WIRE 320 400 320 224
WIRE 320 400 32 400
WIRE 592 400 320 400
WIRE 832 400 752 400
WIRE 912 400 832 400
WIRE 1680 400 1600 400
WIRE 1760 400 1680 400
WIRE 2192 400 2192 224
WIRE 2192 400 1920 400
WIRE 2480 400 2192 400
WIRE 2864 400 2640 400
WIRE 3120 400 3120 240
WIRE 3120 400 2864 400
WIRE 3408 400 3120 400
WIRE 4272 400 4272 240
WIRE 4272 400 3568 400
WIRE 4480 400 4272 400
WIRE 4752 400 4640 400
WIRE 4800 400 4752 400
WIRE -608 544 -608 400
WIRE 3120 544 3120 400
WIRE -2240 592 -2240 400
WIRE -2096 592 -2240 592
WIRE -1168 592 -1760 592
WIRE -736 592 -1088 592
WIRE 3600 592 3248 592
WIRE 4272 592 3680 592
WIRE 4752 592 4752 400
WIRE 4752 592 4608 592
WIRE -368 608 -368 400
WIRE -272 608 -368 608
WIRE 320 608 320 400
WIRE 320 608 -192 608
WIRE 832 608 832 400
WIRE 832 608 720 608
WIRE 1680 608 1680 400
WIRE 1792 608 1680 608
WIRE 2192 608 2192 400
WIRE 2704 608 2192 608
WIRE 2864 608 2864 400
WIRE 2864 608 2784 608
WIRE 2880 608 2864 608
WIRE -736 720 -736 592
WIRE -736 720 -1104 720
WIRE -96 720 -464 720
WIRE 2976 720 2608 720
WIRE 3248 720 3248 592
WIRE 3616 720 3248 720
WIRE -1104 848 -1104 720
WIRE -1040 848 -1104 848
WIRE -736 848 -736 720
WIRE -736 848 -880 848
WIRE -464 848 -464 720
WIRE -320 848 -464 848
WIRE -96 848 -96 720
WIRE -96 848 -160 848
WIRE 2608 848 2608 720
WIRE 2672 848 2608 848
WIRE 2976 848 2976 720
WIRE 2976 848 2832 848
WIRE 3248 848 3248 720
WIRE 3392 848 3248 848
WIRE 3616 848 3616 720
WIRE 3616 848 3552 848
FLAG -2288 16 Vocm_ref
IOPIN -2288 16 In
FLAG -608 -112 Vop
IOPIN -608 -112 In
FLAG -1968 -32 Vdd
IOPIN -1968 -32 In
FLAG -896 -32 Vdd
IOPIN -896 -32 In
FLAG -896 352 Vdd
IOPIN -896 352 In
FLAG -1968 352 Vdd
IOPIN -1968 352 In
FLAG -2128 -32 CK_PHI2
IOPIN -2128 -32 In
FLAG -2128 352 CK_PHI2
IOPIN -2128 352 In
FLAG -1056 -32 CK_PHI1
IOPIN -1056 -32 In
FLAG -1056 352 CK_PHI1
IOPIN -1056 352 In
FLAG -2128 64 CK_PHI2_BAR
IOPIN -2128 64 In
FLAG -2128 448 CK_PHI2_BAR
IOPIN -2128 448 In
FLAG -1056 64 CK_PHI1_BAR
IOPIN -1056 64 In
FLAG -1056 448 CK_PHI1_BAR
IOPIN -1056 448 In
FLAG -2288 400 Vbias
IOPIN -2288 400 In
FLAG -608 544 Vctr
IOPIN -608 544 Out
FLAG -160 896 Vdd
IOPIN -160 896 In
FLAG -320 896 CK_PHI2_BAR
IOPIN -320 896 In
FLAG -320 800 CK_PHI2
IOPIN -320 800 In
FLAG -1040 896 Vdd
IOPIN -1040 896 In
FLAG -880 896 CK_PHI1_BAR
IOPIN -880 896 In
FLAG -880 800 CK_PHI1
IOPIN -880 800 In
FLAG 32 -32 Vdd
IOPIN 32 -32 In
FLAG 32 352 Vdd
IOPIN 32 352 In
FLAG -128 -32 CK_PHI2
IOPIN -128 -32 In
FLAG -128 352 CK_PHI2
IOPIN -128 352 In
FLAG -128 64 CK_PHI2_BAR
IOPIN -128 64 In
FLAG -128 448 CK_PHI2_BAR
IOPIN -128 448 In
FLAG 912 16 Vocm_ref
IOPIN 912 16 In
FLAG 592 -32 Vdd
IOPIN 592 -32 In
FLAG 592 352 Vdd
IOPIN 592 352 In
FLAG 752 -32 CK_PHI1
IOPIN 752 -32 In
FLAG 752 352 CK_PHI1
IOPIN 752 352 In
FLAG 752 64 CK_PHI1_BAR
IOPIN 752 64 In
FLAG 752 448 CK_PHI1_BAR
IOPIN 752 448 In
FLAG 912 400 Vbias
IOPIN 912 400 In
FLAG -160 -416 Vdd
IOPIN -160 -416 In
FLAG -320 -416 CK_PHI2_BAR
IOPIN -320 -416 In
FLAG -320 -320 CK_PHI2
IOPIN -320 -320 In
FLAG -1040 -416 Vdd
IOPIN -1040 -416 In
FLAG -880 -416 CK_PHI1_BAR
IOPIN -880 -416 In
FLAG -880 -320 CK_PHI1
IOPIN -880 -320 In
FLAG 4800 16 Vocm_ref
IOPIN 4800 16 In
FLAG 3120 -112 Vom
IOPIN 3120 -112 In
FLAG 4480 -32 Vdd
IOPIN 4480 -32 In
FLAG 3408 -32 Vdd
IOPIN 3408 -32 In
FLAG 3408 352 Vdd
IOPIN 3408 352 In
FLAG 4480 352 Vdd
IOPIN 4480 352 In
FLAG 4640 -32 CK_PHI2
IOPIN 4640 -32 In
FLAG 4640 352 CK_PHI2
IOPIN 4640 352 In
FLAG 3568 -32 CK_PHI1
IOPIN 3568 -32 In
FLAG 3568 352 CK_PHI1
IOPIN 3568 352 In
FLAG 4640 64 CK_PHI2_BAR
IOPIN 4640 64 In
FLAG 4640 448 CK_PHI2_BAR
IOPIN 4640 448 In
FLAG 3568 64 CK_PHI1_BAR
IOPIN 3568 64 In
FLAG 3568 448 CK_PHI1_BAR
IOPIN 3568 448 In
FLAG 4800 400 Vbias
IOPIN 4800 400 In
FLAG 3120 544 Vctr
IOPIN 3120 544 Out
FLAG 2672 896 Vdd
IOPIN 2672 896 In
FLAG 2832 896 CK_PHI2_BAR
IOPIN 2832 896 In
FLAG 2832 800 CK_PHI2
IOPIN 2832 800 In
FLAG 3552 896 Vdd
IOPIN 3552 896 In
FLAG 3392 896 CK_PHI1_BAR
IOPIN 3392 896 In
FLAG 3392 800 CK_PHI1
IOPIN 3392 800 In
FLAG 2480 -32 Vdd
IOPIN 2480 -32 In
FLAG 2480 352 Vdd
IOPIN 2480 352 In
FLAG 2640 -32 CK_PHI2
IOPIN 2640 -32 In
FLAG 2640 352 CK_PHI2
IOPIN 2640 352 In
FLAG 2640 64 CK_PHI2_BAR
IOPIN 2640 64 In
FLAG 2640 448 CK_PHI2_BAR
IOPIN 2640 448 In
FLAG 1600 16 Vocm_ref
IOPIN 1600 16 In
FLAG 1920 -32 Vdd
IOPIN 1920 -32 In
FLAG 1920 352 Vdd
IOPIN 1920 352 In
FLAG 1760 -32 CK_PHI1
IOPIN 1760 -32 In
FLAG 1760 352 CK_PHI1
IOPIN 1760 352 In
FLAG 1760 64 CK_PHI1_BAR
IOPIN 1760 64 In
FLAG 1760 448 CK_PHI1_BAR
IOPIN 1760 448 In
FLAG 1600 400 Vbias
IOPIN 1600 400 In
FLAG 2672 -416 Vdd
IOPIN 2672 -416 In
FLAG 2832 -416 CK_PHI2_BAR
IOPIN 2832 -416 In
FLAG 2832 -320 CK_PHI2
IOPIN 2832 -320 In
FLAG 3552 -416 Vdd
IOPIN 3552 -416 In
FLAG 3392 -416 CK_PHI1_BAR
IOPIN 3392 -416 In
FLAG 3392 -320 CK_PHI1
IOPIN 3392 -320 In
SYMBOL tgate -976 16 R0
SYMATTR InstName X1
SYMBOL tgate -976 400 R0
SYMATTR InstName X2
SYMBOL tgate -2048 16 R0
SYMATTR InstName X3
SYMBOL tgate -2048 400 R0
SYMATTR InstName X4
SYMBOL cap -1776 176 R0
SYMATTR InstName C1
SYMATTR Value {C1}
SYMBOL cap -624 176 R0
SYMATTR InstName C2
SYMATTR Value {C2}
SYMBOL tgate -240 848 M180
SYMATTR SpiceLine L=0.28u Wn={Wn_d} Wp={Wp_d} M=1
SYMATTR InstName X5
SYMBOL tgate -960 848 R180
SYMATTR SpiceLine L=0.28u Wn={Wn_d} Wp={Wp_d} M=1
SYMATTR InstName X11
SYMBOL tgate -48 16 R0
SYMATTR InstName X7
SYMBOL tgate -48 400 R0
SYMATTR InstName X8
SYMBOL tgate 672 16 M0
SYMATTR InstName X9
SYMBOL tgate 672 400 M0
SYMATTR InstName X10
SYMBOL cap 304 160 R0
SYMATTR InstName C3
SYMATTR Value {C1}
SYMBOL tgate -240 -368 R0
SYMATTR SpiceLine L=0.28u Wn={Wn_d} Wp={Wp_d} M=1
SYMATTR InstName X21
SYMBOL tgate -960 -368 M0
SYMATTR SpiceLine L=0.28u Wn={Wn_d} Wp={Wp_d} M=1
SYMATTR InstName X22
SYMBOL res -1072 576 R90
WINDOW 0 0 56 VBottom 2
WINDOW 3 32 56 VTop 2
SYMATTR InstName R1
SYMATTR Value 1000G
SYMBOL res -176 592 R90
WINDOW 0 0 56 VBottom 2
WINDOW 3 32 56 VTop 2
SYMATTR InstName R2
SYMATTR Value 1000G
SYMBOL res -1072 -160 R90
WINDOW 0 0 56 VBottom 2
WINDOW 3 32 56 VTop 2
SYMATTR InstName R3
SYMATTR Value 1000G
SYMBOL res -160 -160 R90
WINDOW 0 0 56 VBottom 2
WINDOW 3 32 56 VTop 2
SYMATTR InstName R4
SYMATTR Value 1000G
SYMBOL res 736 592 R90
WINDOW 0 0 56 VBottom 2
WINDOW 3 32 56 VTop 2
SYMATTR InstName R5
SYMATTR Value 1000G
SYMBOL res -2000 576 R90
WINDOW 0 0 56 VBottom 2
WINDOW 3 32 56 VTop 2
SYMATTR InstName R6
SYMATTR Value 1000G
SYMBOL res -2000 -160 R90
WINDOW 0 0 56 VBottom 2
WINDOW 3 32 56 VTop 2
SYMATTR InstName R7
SYMATTR Value 1000G
SYMBOL res 736 -160 R90
WINDOW 0 0 56 VBottom 2
WINDOW 3 32 56 VTop 2
SYMATTR InstName R8
SYMATTR Value 1000G
SYMBOL tgate 3488 16 M0
SYMATTR InstName X6
SYMBOL tgate 3488 400 M0
SYMATTR InstName X12
SYMBOL tgate 4560 16 M0
SYMATTR InstName X13
SYMBOL tgate 4560 400 M0
SYMATTR InstName X14
SYMBOL cap 4288 176 M0
SYMATTR InstName C4
SYMATTR Value {C1}
SYMBOL cap 3136 176 M0
SYMATTR InstName C5
SYMATTR Value {C2}
SYMBOL tgate 2752 848 R180
SYMATTR SpiceLine L=0.28u Wn={Wn_d} Wp={Wp_d} M=1
SYMATTR InstName X15
SYMBOL tgate 3472 848 M180
SYMATTR SpiceLine L=0.28u Wn={Wn_d} Wp={Wp_d} M=1
SYMATTR InstName X16
SYMBOL tgate 2560 16 M0
SYMATTR InstName X17
SYMBOL tgate 2560 400 M0
SYMATTR InstName X18
SYMBOL tgate 1840 16 R0
SYMATTR InstName X19
SYMBOL tgate 1840 400 R0
SYMATTR InstName X20
SYMBOL cap 2208 160 M0
SYMATTR InstName C6
SYMATTR Value {C1}
SYMBOL tgate 2752 -368 M0
SYMATTR SpiceLine L=0.28u Wn={Wn_d} Wp={Wp_d} M=1
SYMATTR InstName X23
SYMBOL tgate 3472 -368 R0
SYMATTR SpiceLine L=0.28u Wn={Wn_d} Wp={Wp_d} M=1
SYMATTR InstName X24
SYMBOL res 3584 576 M90
WINDOW 0 0 56 VBottom 2
WINDOW 3 32 56 VTop 2
SYMATTR InstName R9
SYMATTR Value 1000G
SYMBOL res 2688 592 M90
WINDOW 0 0 56 VBottom 2
WINDOW 3 32 56 VTop 2
SYMATTR InstName R10
SYMATTR Value 1000G
SYMBOL res 3584 -160 M90
WINDOW 0 0 56 VBottom 2
WINDOW 3 32 56 VTop 2
SYMATTR InstName R11
SYMATTR Value 1000G
SYMBOL res 2672 -160 M90
WINDOW 0 0 56 VBottom 2
WINDOW 3 32 56 VTop 2
SYMATTR InstName R12
SYMATTR Value 1000G
SYMBOL res 1776 592 M90
WINDOW 0 0 56 VBottom 2
WINDOW 3 32 56 VTop 2
SYMATTR InstName R13
SYMATTR Value 1000G
SYMBOL res 4512 576 M90
WINDOW 0 0 56 VBottom 2
WINDOW 3 32 56 VTop 2
SYMATTR InstName R14
SYMATTR Value 1000G
SYMBOL res 4512 -160 M90
WINDOW 0 0 56 VBottom 2
WINDOW 3 32 56 VTop 2
SYMATTR InstName R15
SYMATTR Value 1000G
SYMBOL res 1776 -160 M90
WINDOW 0 0 56 VBottom 2
WINDOW 3 32 56 VTop 2
SYMATTR InstName R16
SYMATTR Value 1000G
TEXT -1064 -120 Left 2 ;PHI2
TEXT -992 504 Left 2 ;PHI2
TEXT -2072 -112 Left 2 ;PHI1
TEXT -2072 528 Left 2 ;PHI1
TEXT -1720 -584 Left 2 !.param C1=20f C2=20f/10
TEXT -1744 -624 Left 2 ;All SWITCHES ARE TRANSMISSION GATES 3:1
TEXT -1720 -528 Left 2 !.param Wn_d=1u/2 Wp_d=3u/2
TEXT -136 -104 Left 2 ;PHI2
TEXT -64 504 Left 2 ;PHI2
TEXT 696 -112 Right 2 ;PHI1
TEXT 696 528 Right 2 ;PHI1
TEXT -256 -264 Left 2 ;PHI2
TEXT -944 -264 Right 2 ;PHI2
TEXT 3576 -120 Right 2 ;PHI2
TEXT 3504 504 Right 2 ;PHI2
TEXT 4584 -112 Right 2 ;PHI1
TEXT 4584 528 Right 2 ;PHI1
TEXT 2648 -104 Right 2 ;PHI2
TEXT 2576 504 Right 2 ;PHI2
TEXT 1816 -112 Left 2 ;PHI1
TEXT 1816 528 Left 2 ;PHI1
TEXT 2768 -264 Right 2 ;PHI2
TEXT 3456 -264 Left 2 ;PHI2

The netlist it stands for:
* ota_v2.asc
M1 X Vip N006 0 nmos_3p3 l='Lpair' w='Wpair' m=1
M2 Y Vim N006 0 nmos_3p3 l='Lpair' w='Wpair' m=1
M3 N006 vm1 0 0 nmos_3p3 l='Ltail' w='Wtail/Mtail' m=Mtail
M4 vm1 vm1 0 0 nmos_3p3 l='Ltail' w='Wtail/Mtail' m=1
V1 Vdd 0 3.3
V2 N011 0 {Vicm}
V3 Vip N011 {vid/2} AC 0.5
V4 N011 Vim {vid/2} AC 0.5
M5 Vdd d X Vdd pmos_3p3 l='Lmirr' w='W5/3' m=3
M6 X c Vom Vdd pmos_3p3 l='Lcas' w='W3/2' m=2
M7 Vom a N007 0 nmos_3p3 l='Lcas' w='W7'
M8 N007 b 0 0 nmos_3p3 l='Lmirr' w='a*W9'
M10 Vdd d Y Vdd pmos_3p3 l='Lmirr' w='W5/3' m=3
M11 Y c Vop Vdd pmos_3p3 l='Lcas' w='W3/2' m=2
M12 Vop a N008 0 nmos_3p3 l='Lcas' w='W7'
M13 N008 b 0 0 nmos_3p3 l='Lmirr' w='a*W9'
V7 Vocm_target 0 1.65
M15 N007 vctr 0 0 nmos_3p3 l='Lmirr' w='(1-a)*W9'
M16 N008 vctr 0 0 nmos_3p3 l='Lmirr' w='(1-a)*W9'
C1 Vom 0 100f
C2 Vop 0 100f
I1 N001 N004 500n
M9 N005 vm1 0 0 nmos_3p3 l='Ltail' w='Wtail/Mtail' m=Mp
M17 Vdd N005 N005 Vdd pmos_3p3 l='Lcopy' w='Wcopy_p'
M18 Vdd N005 a Vdd pmos_3p3 l='Lcopy' w='Wcopy_p'
M27 c vm1 0 0 nmos_3p3 l='Ltail' w='Wtail/Mtail' m=Mn
M29 N004 N004 vm1 0 nmos_3p3 l=4.48u w=2.64u m=3
M34 Vdd N001 N001 Vdd pmos_3p3 l=4.48u w='Wcopy_p'
M24 N009 a 0 0 nmos_3p3 l='Lmirr' w='(1/3)*W9' m=1
M25 a a N009 0 nmos_3p3 l='Lcas' w='W7' m=1
M26 N010 b 0 0 nmos_3p3 l='Lmirr' w='W9' m=1
M28 b a N010 0 nmos_3p3 l='Lcas' w='W7' m=1
M30 Vdd c N002 Vdd pmos_3p3 l='Lmirr' w='(1/3)*W5/3'
M31 N002 c c Vdd pmos_3p3 l='Lcas' w='W3/2' m=1
M35 Vdd d N003 Vdd pmos_3p3 l='Lmirr' w='W5/3' m=1
M36 N003 c d Vdd pmos_3p3 l='Lcas' w='W3/2' m=1
M37 d vm1 0 0 nmos_3p3 l='Ltail' w='Wtail/Mtail' m=Mn
M38 Vdd N005 b Vdd pmos_3p3 l='Lcopy' w='Wcopy_p'
V8 CK_MASTER 0 PULSE(0 3.3 0 1n 1n 50n 100n)
XX4 CK_MASTER Vdd CK_PHI1 CK_PHI1_BAR CK_PHI2 CK_PHI2_BAR phase_gen
XX5 CK_PHI1 CK_PHI1_BAR CK_PHI2 CK_PHI2_BAR b Vdd Vocm_target Vom Vop vctr cs_cmfb_v2

* block symbol definitions
.subckt phase_gen CK Vdd CK1 CK1_BAR CK2 CK2_BAR
XX1 CK CK2_FB Vdd 0 N001 nor2x1
XX2 CK Vdd CK_BAR 0 invx1
XX5 CK_BAR CK1_FB Vdd 0 N006 nor2x1
XX6 CK2 Vdd N008 0 invx1
XX7 N008 Vdd N009 0 invx1
XX8 N001 Vdd CK1_BAR 0 invx1
XX9 N006 Vdd CK2_BAR 0 invx1
XX10 N009 Vdd N010 0 invx1
XX11 N010 Vdd CK2_FB 0 invx1
XX3 CK1 Vdd N003 0 invx1
XX4 N003 Vdd N004 0 invx1
XX12 N004 Vdd N005 0 invx1
XX13 N005 Vdd CK1_FB 0 invx1
XX14 Vdd 0 N001 Vdd N002 tgate L=0.28u Wn=1u Wp=3u M={M}  ; pins A A_bar IN Vdd OUT
XX15 Vdd 0 N006 Vdd N007 tgate L=0.28u Wn=1u Wp=3u M={M}  ; pins A A_bar IN Vdd OUT
XX16 Vdd 0 N002 Vdd CK1 tgate L=0.28u Wn=1u Wp=3u M={M}  ; pins A A_bar IN Vdd OUT
XX17 Vdd 0 N007 Vdd CK2 tgate L=0.28u Wn=1u Wp=3u M={M}  ; pins A A_bar IN Vdd OUT
.param M=1
.ends phase_gen

.subckt nor2x1 A B Vdd Vee X
M1 X B Vee Vee nmos_3p3 l={L} w={Wn}
M3 N001 A X Vdd pmos_3p3 l={L} w={Wp}
M4 Vdd B N001 Vdd pmos_3p3 l={L} w={Wp}
M2 X A Vee Vee nmos_3p3 l={L} w={Wn}
.param Wp=6u Wn=1u L=0.28u
.ends nor2x1

.subckt invx1 A Vdd X Vee
M1 X A Vee Vee nmos_3p3 l={L} w={Wn}
M2 Vdd A X Vdd pmos_3p3 l={L} w={Wp}
.param Wp=3u Wn=1u L=0.28u
.ends invx1

.subckt cs_cmfb_v2 CK_PHI1 CK_PHI1_BAR CK_PHI2 CK_PHI2_BAR Vbias Vdd Vocm_ref Vom Vop Vctr
XX1 CK_PHI1 CK_PHI1_BAR N009 Vdd Vop tgate L=0.28u Wn=1u Wp=3u M=1  ; pins A A_bar IN Vdd OUT
XX2 CK_PHI1 CK_PHI1_BAR N011 Vdd Vctr tgate L=0.28u Wn=1u Wp=3u M=1  ; pins A A_bar IN Vdd OUT
XX3 CK_PHI2 CK_PHI2_BAR Vocm_ref Vdd N009 tgate L=0.28u Wn=1u Wp=3u M=1  ; pins A A_bar IN Vdd OUT
XX4 CK_PHI2 CK_PHI2_BAR Vbias Vdd N011 tgate L=0.28u Wn=1u Wp=3u M=1  ; pins A A_bar IN Vdd OUT
C1 N009 N011 {C1}
C2 Vop Vctr {C2}
XX5 CK_PHI2_BAR CK_PHI2 N019 Vdd N019 tgate L=0.28u Wn={Wn_d} Wp={Wp_d} M=1  ; pins A A_bar IN Vdd OUT
XX11 CK_PHI1_BAR CK_PHI1 N016 Vdd N016 tgate L=0.28u Wn={Wn_d} Wp={Wp_d} M=1  ; pins A A_bar IN Vdd OUT
XX7 CK_PHI2 CK_PHI2_BAR Vop Vdd N006 tgate L=0.28u Wn=1u Wp=3u M=1  ; pins A A_bar IN Vdd OUT
XX8 CK_PHI2 CK_PHI2_BAR Vctr Vdd N012 tgate L=0.28u Wn=1u Wp=3u M=1  ; pins A A_bar IN Vdd OUT
XX9 CK_PHI1 CK_PHI1_BAR Vocm_ref Vdd N006 tgate L=0.28u Wn=1u Wp=3u M=1  ; pins A A_bar IN Vdd OUT
XX10 CK_PHI1 CK_PHI1_BAR Vbias Vdd N012 tgate L=0.28u Wn=1u Wp=3u M=1  ; pins A A_bar IN Vdd OUT
C3 N006 N012 {C1}
XX21 CK_PHI2_BAR CK_PHI2 N002 Vdd N002 tgate L=0.28u Wn={Wn_d} Wp={Wp_d} M=1  ; pins A A_bar IN Vdd OUT
XX22 CK_PHI1_BAR CK_PHI1 N001 Vdd N001 tgate L=0.28u Wn={Wn_d} Wp={Wp_d} M=1  ; pins A A_bar IN Vdd OUT
R1 N016 N015 1000G
R2 N012 Vctr 1000G
R3 Vop N005 1000G
R4 N006 Vop 1000G
R5 Vbias NC_01 1000G
R6 NC_02 Vbias 1000G
R7 NC_03 Vocm_ref 1000G
R8 Vocm_ref NC_04 1000G
XX6 CK_PHI1 CK_PHI1_BAR N010 Vdd Vom tgate L=0.28u Wn=1u Wp=3u M=1  ; pins A A_bar IN Vdd OUT
XX12 CK_PHI1 CK_PHI1_BAR N014 Vdd Vctr tgate L=0.28u Wn=1u Wp=3u M=1  ; pins A A_bar IN Vdd OUT
XX13 CK_PHI2 CK_PHI2_BAR Vocm_ref Vdd N010 tgate L=0.28u Wn=1u Wp=3u M=1  ; pins A A_bar IN Vdd OUT
XX14 CK_PHI2 CK_PHI2_BAR Vbias Vdd N014 tgate L=0.28u Wn=1u Wp=3u M=1  ; pins A A_bar IN Vdd OUT
C4 N010 N014 {C1}
C5 Vom Vctr {C2}
XX15 CK_PHI2_BAR CK_PHI2 N020 Vdd N020 tgate L=0.28u Wn={Wn_d} Wp={Wp_d} M=1  ; pins A A_bar IN Vdd OUT
XX16 CK_PHI1_BAR CK_PHI1 N017 Vdd N017 tgate L=0.28u Wn={Wn_d} Wp={Wp_d} M=1  ; pins A A_bar IN Vdd OUT
XX17 CK_PHI2 CK_PHI2_BAR Vom Vdd N007 tgate L=0.28u Wn=1u Wp=3u M=1  ; pins A A_bar IN Vdd OUT
XX18 CK_PHI2 CK_PHI2_BAR Vctr Vdd N013 tgate L=0.28u Wn=1u Wp=3u M=1  ; pins A A_bar IN Vdd OUT
XX19 CK_PHI1 CK_PHI1_BAR Vocm_ref Vdd N007 tgate L=0.28u Wn=1u Wp=3u M=1  ; pins A A_bar IN Vdd OUT
XX20 CK_PHI1 CK_PHI1_BAR Vbias Vdd N013 tgate L=0.28u Wn=1u Wp=3u M=1  ; pins A A_bar IN Vdd OUT
C6 N007 N013 {C1}
XX23 CK_PHI2_BAR CK_PHI2 N003 Vdd N003 tgate L=0.28u Wn={Wn_d} Wp={Wp_d} M=1  ; pins A A_bar IN Vdd OUT
XX24 CK_PHI1_BAR CK_PHI1 N004 Vdd N004 tgate L=0.28u Wn={Wn_d} Wp={Wp_d} M=1  ; pins A A_bar IN Vdd OUT
R9 N017 N018 1000G
R10 N013 Vctr 1000G
R11 N004 N008 1000G
R12 N007 Vom 1000G
R13 Vbias NC_05 1000G
R14 NC_06 Vbias 1000G
R15 NC_07 Vocm_ref 1000G
R16 Vocm_ref NC_08 1000G
* PHI2
* PHI2
* PHI1
* PHI1
.param C1=20f C2=20f/10
* All SWITCHES ARE TRANSMISSION GATES 3:1
.param Wn_d=1u/2 Wp_d=3u/2
* PHI2
* PHI2
* PHI1
* PHI1
* PHI2
* PHI2
* PHI2
* PHI2
* PHI1
* PHI1
* PHI2
* PHI2
* PHI1
* PHI1
* PHI2
* PHI2
.ends cs_cmfb_v2

.model NMOS NMOS
.model PMOS PMOS
.lib standard.mos
.param Wpair=45.2u Lpair=1.12u
.param Wtail=2.64u Ltail=4.48u Mtail=4
.param vid=0 Vicm=1.65
.inc ..\..\gf180\cmos_tt.txt
* .op
.param W5=22.99u W3=7.92u W7=1.92u W9=3.53u Lmirr=2.24u Lcas=0.84u
.param Vocm_target=1.65
.tran 5u
.param a=0.7
* .ac dec 1000 1 10G
* .dc param vid -2m 2m 10u
.meas dc_gain max mag(V(vop)-V(vom))
.meas ac bw find mag(V(vop)-V(vom)) when mag(V(vop)-V(vom))=dc_gain/sqrt(2)
.param Lcopy=2.24u Wcopy_p=34.48u
* Master CURRENT BRANCH
* INPUT DIFFERENTIAL PAIR
* .noise V(vop,vom) V3 dec 1000 1 200k
.meas noise VNOISE_RMS integ V(onoise)
;.ic V(Vom)=1.65 V(Vop)=1.65
.param Mn=2 Mp=4
.measure tran iavg AVG i(V1) from=2u to=2.1u
.measure tran iclk_phi_avg AVG i(V8) from=2u to=2.1u
.measure tran pclk2 PARAM='-iclk_phi_avg*3.3'
.measure tran pavg PARAM='-iavg*3.3'
.measure tran ptot PARAM='pavg+pclk2'
.backanno
.end